# Altium project CPU_Board_V1_2.PrjPcb (part 1 of 2)
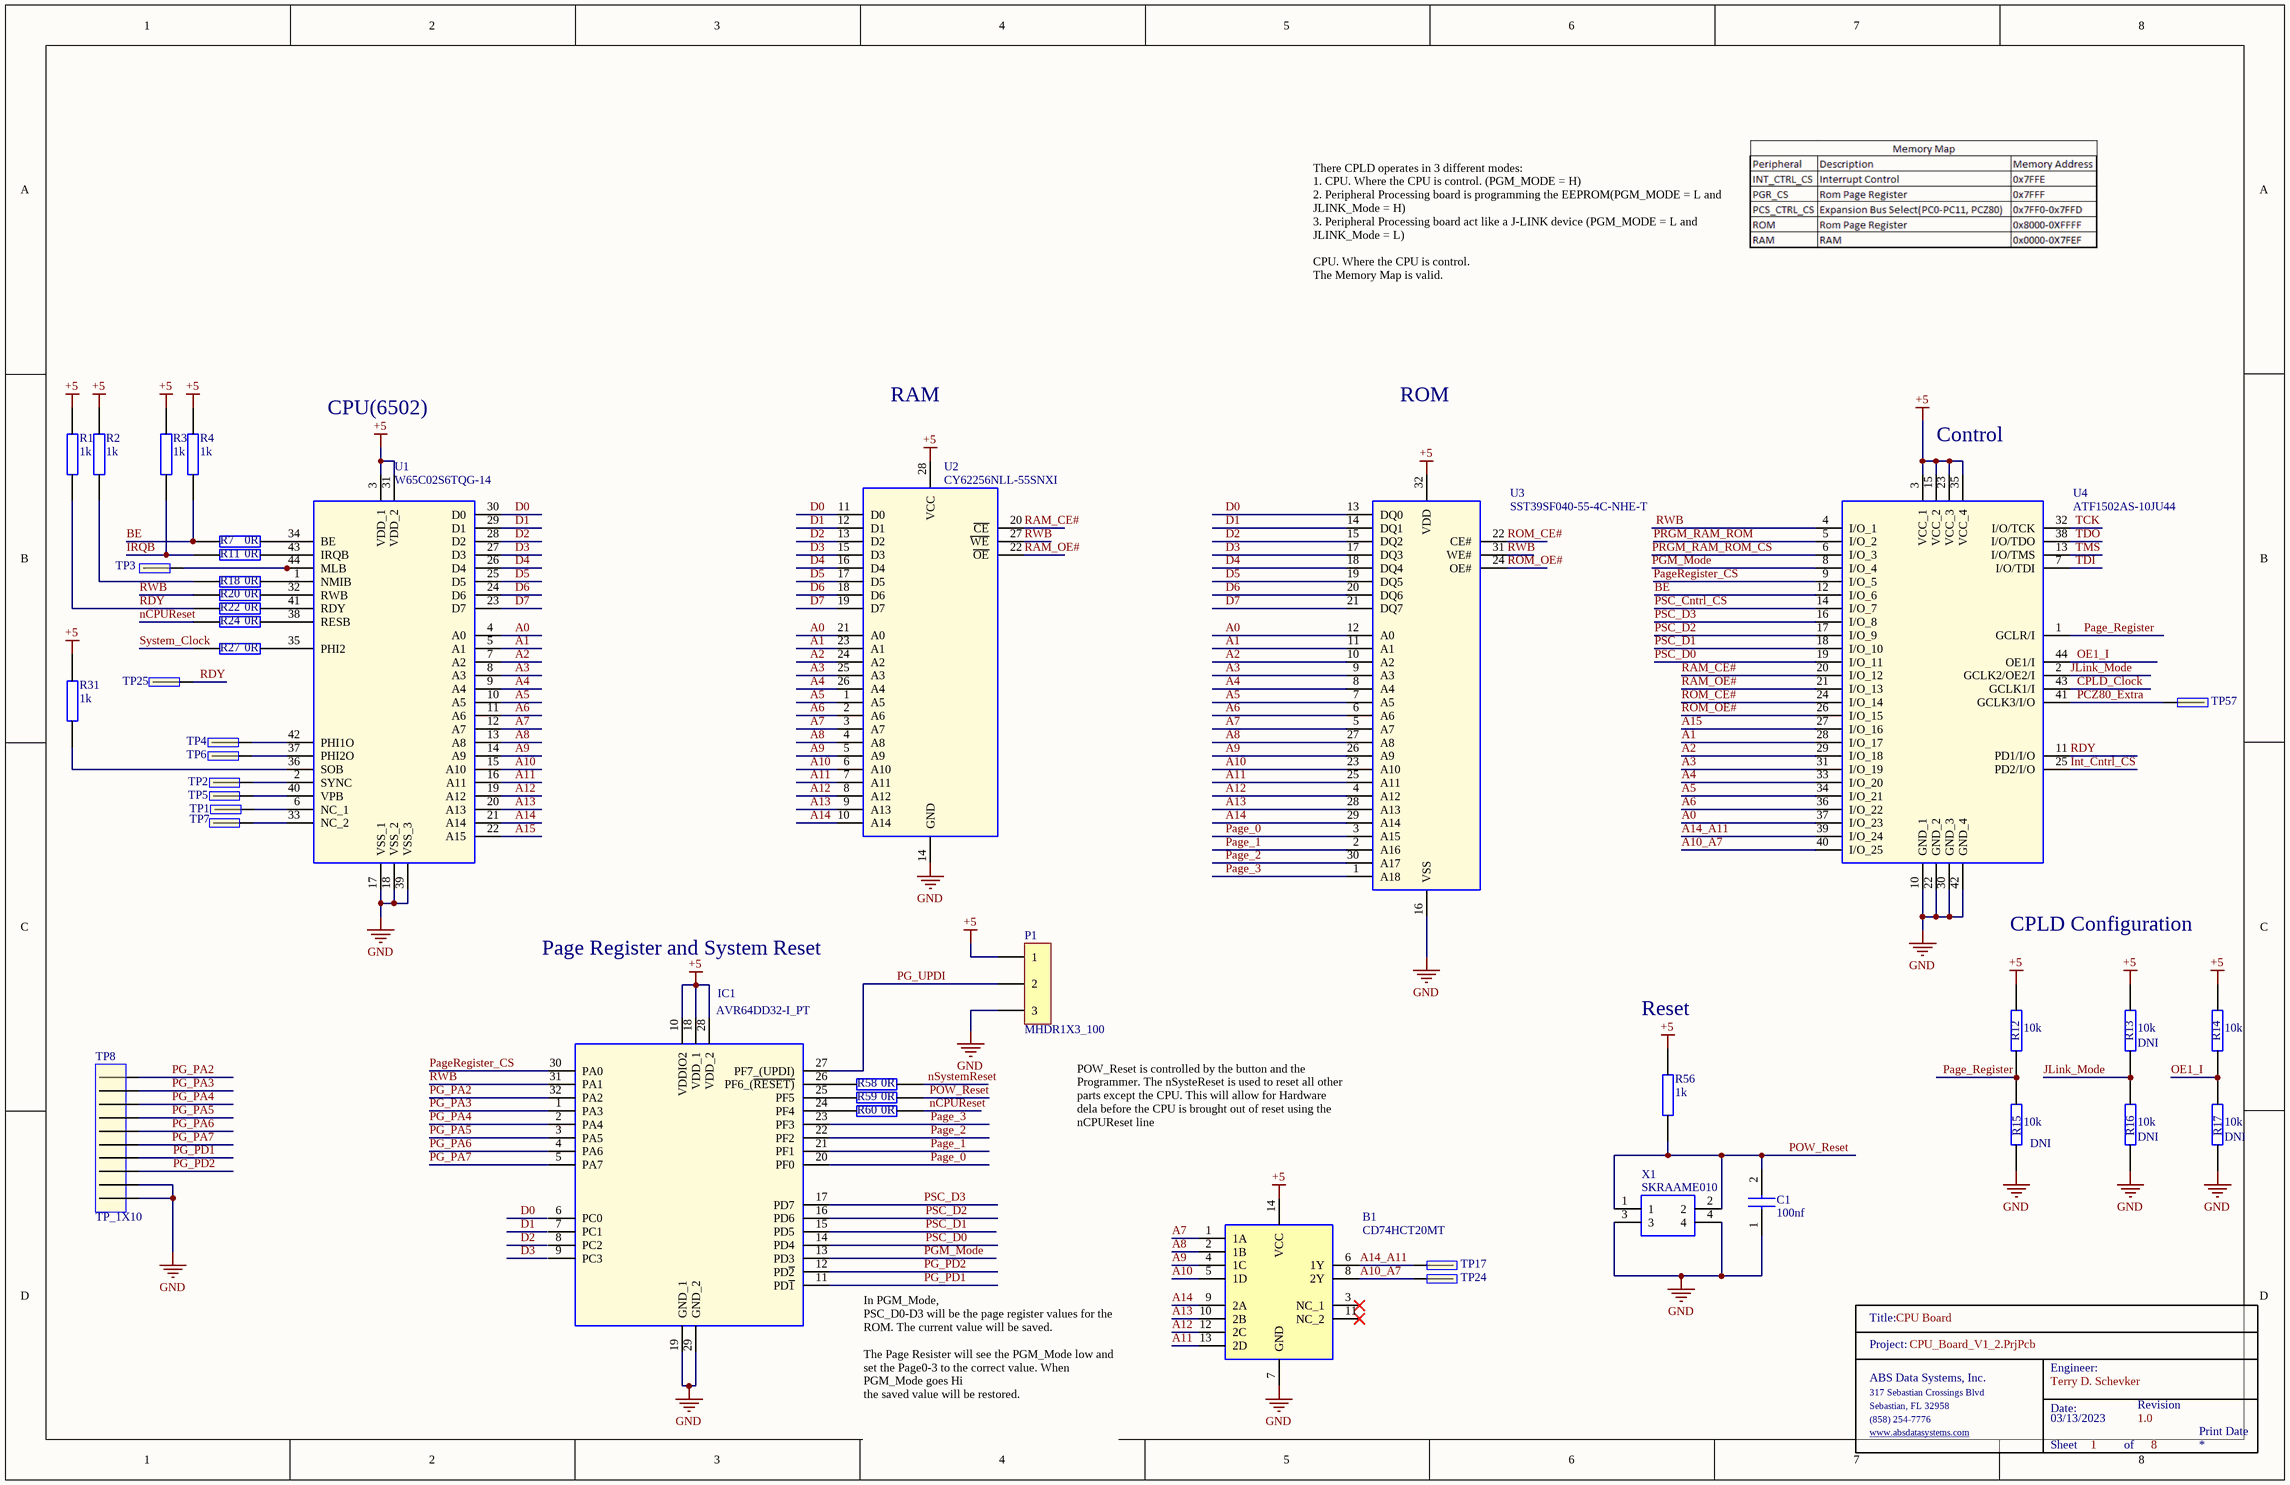
[diagram p0: CPU_Board.SchDoc]
8 sheets, 394 parts. Net scope: global (net labels, ports and power ports of the same name join across sheets).
Board file: 6502_CPU_MainBoard_PCB_V1_2.PcbDoc
Sheets:
  CPU_Board.SchDoc
  LED_Monitor.SchDoc
  LED_Monitor_2.SchDoc
  Peripherial_Bus.SchDoc
  PowerSupply.SchDoc
  Programmer_Interface.SchDoc
  TestPoints.SchDoc
  Z80_Interface.SchDoc

## Sheet CPU_Board.SchDoc: CPU Board
size Tabloid; Date: 03/13/2023; Engineer: Terry D. Schevker; Revision: 1.0; SheetNumber: 1; SheetTotal: 8

### Parts
B1  CD74HCT20MT  [SOIC127P600X175-14N]
C1  100nf  [0603]
IC1  AVR64DD32-I_PT  [QFP80P900X900X120-32N]
P1  MHDR1X3_100  [MHDR1X3_100]
R1  1k  [0603]
R2  1k  [0603]
R3  1k  [0603]
R4  1k  [0603]
R7  0R  [0603]
R11  0R  [0603]
R12  10k  [0603]
R13  10k  [0603]
R14  10k  [0603]
R15  10k  [0603]
R16  10k  [0603]
R17  10k  [0603]
R18  0R  [0603]
R20  0R  [0603]
R22  0R  [0603]
R24  0R  [0603]
R27  0R  [0603]
R31  1k  [0603]
R56  1k  [0603]
R58  0R  [0603]
R59  0R  [0603]
R60  0R  [0603]
TitleBlock_1  TitleBlock  (value not drawn)  (graphical)
TP1  TP  [TP]  (value not drawn)
TP2  TP  [TP]  (value not drawn)
TP3  TP  [TP]  (value not drawn)
TP4  TP  [TP]  (value not drawn)
TP5  TP  [TP]  (value not drawn)
TP6  TP  [TP]  (value not drawn)
TP7  TP  [TP]  (value not drawn)
TP8  TP_1X10  [TP_1X10]
TP17  TP  [TP]  (value not drawn)
TP24  TP  [TP]  (value not drawn)
TP25  TP  [TP]  (value not drawn)
TP57  TP  [TP]  (value not drawn)
U1  W65C02S6TQG-14  [QFP-44]
U2  CY62256NLL-55SNXI  [SOP-28]
U3  SST39SF040-55-4C-NHE-T  [plcc-32]
U4  ATF1502AS-10JU44  [PLCC-44N]
X1  SKRAAME010  [SKRAAME010]

### Nets
+5: B1.14(VCC) IC1.10(VDDIO2) IC1.18(VDD_1) IC1.28(VDD_2) P1.1 R1.2 R2.2 R3.2 R4.2 R12.1 R13.1 R14.1 R31.2 R56.1 U1.3(VDD_1) U1.31(VDD_2) U2.28(VCC) U3.32(VDD) U4.3(VCC_1) U4.15(VCC_2) U4.23(VCC_3) U4.35(VCC_4)
GND: B1.7(GND) C1.1 IC1.19(GND_1) IC1.29(GND_2) P1.3 R15.2 R16.2 R17.2 TP8.9 TP8.10 U1.17(VSS_1) U1.18(VSS_2) U1.39(VSS_3) U2.14(GND) U3.16(VSS) U4.10(GND_1) U4.22(GND_2) U4.30(GND_3) U4.42(GND_4) X1.3 X1.4
A0: U1.4(A0) U2.21(A0) U3.12(A0) U4.37(I/O_23)
A1: U1.5(A1) U2.23(A1) U3.11(A1) U4.28(I/O_17)
A2: U1.7(A2) U2.24(A2) U3.10(A2) U4.29(I/O_18)
A3: U1.8(A3) U2.25(A3) U3.9(A3) U4.31(I/O_19)
A4: U1.9(A4) U2.26(A4) U3.8(A4) U4.33(I/O_20)
A5: U1.10(A5) U2.1(A5) U3.7(A5) U4.34(I/O_21)
A6: U1.11(A6) U2.2(A6) U3.6(A6) U4.36(I/O_22)
A7: B1.1(1A) U1.12(A7) U2.3(A7) U3.5(A7)
A8: B1.2(1B) U1.13(A8) U2.4(A8) U3.27(A8)
A9: B1.4(1C) U1.14(A9) U2.5(A9) U3.26(A9)
A10: B1.5(1D) U1.15(A10) U2.6(A10) U3.23(A10)
A10_A7: B1.8(2Y) TP24.1 U4.40(I/O_25)
A11: B1.13(2D) U1.16(A11) U2.7(A11) U3.25(A11)
A12: B1.12(2C) U1.19(A12) U2.8(A12) U3.4(A12)
A13: B1.10(2B) U1.20(A13) U2.9(A13) U3.28(A13)
A14: B1.9(2A) U1.21(A14) U2.10(A14) U3.29(A14)
A14_A11: B1.6(1Y) TP17.1 U4.39(I/O_24)
A15: U1.22(A15) U4.27(I/O_16)
BE: R4.1 R7.1 U4.12(I/O_6)
CPLD_Clock: U4.43(GCLK1/I)
D0: U1.30(D0) U2.11(D0) U3.13(DQ0)
D1: U1.29(D1) U2.12(D1) U3.14(DQ1)
D2: U1.28(D2) U2.13(D2) U3.15(DQ2)
D3: U1.27(D3) U2.15(D3) U3.17(DQ3)
D4: U1.26(D4) U2.16(D4) U3.18(DQ4)
D5: U1.25(D5) U2.17(D5) U3.19(DQ5)
D6: U1.24(D6) U2.18(D6) U3.20(DQ6)
D7: U1.23(D7) U2.19(D7) U3.21(DQ7)
Int_Cntrl_CS: U4.25(PD2/I/O)
IRQB: R3.1 R11.1
JLink_Mode: R13.2 R16.1 U4.2(GCLK2/OE2/I)
nCPUReset: R24.1 R60.2
nSystemReset: R58.2
OE1_I: R14.2 R17.1 U4.44(OE1/I)
Page_0: IC1.20(PF0) U3.3(A15)
Page_1: IC1.21(PF1) U3.2(A16)
Page_2: IC1.22(PF2) U3.30(A17)
Page_3: IC1.23(PF3) U3.1(A18)
Page_Register: R12.2 R15.1 U4.1(GCLR/I)
PageRegister_CS: IC1.30(PA0) U4.9(I/O_5)
PCZ80_Extra: TP57.1 U4.41(GCLK3/I/O)
PG_PA2: IC1.32(PA2) TP8.1
PG_PA3: IC1.1(PA3) TP8.2
PG_PA4: IC1.2(PA4) TP8.3
PG_PA5: IC1.3(PA5) TP8.4
PG_PA6: IC1.4(PA6) TP8.5
PG_PA7: IC1.5(PA7) TP8.6
PG_PD1: IC1.11(PD~{1}) TP8.7
PG_PD2: IC1.12(PD~{2}) TP8.8
PG_UPDI: IC1.27(PF7_(UPDI)) P1.2
PGM_Mode: IC1.13(PD3) U4.8(I/O_4)
POW_Reset: C1.2 R56.2 R59.2 X1.1 X1.2
PRGM_RAM_ROM: U4.5(I/O_2)
PRGM_RAM_ROM_CS: U4.6(I/O_3)
PSC_Cntrl_CS: U4.14(I/O_7)
PSC_D0: IC1.14(PD4) U4.19(I/O_11)
PSC_D1: IC1.15(PD5) U4.18(I/O_10)
PSC_D2: IC1.16(PD6) U4.17(I/O_9)
PSC_D3: IC1.17(PD7) U4.16(I/O_8)
RAM_CE#: U2.20(~{CE}) U4.20(I/O_12)
RAM_OE#: U2.22(~{OE}) U4.21(I/O_13)
RDY: R1.1 R22.1 TP25.1 U4.11(PD1/I/O)
ROM_CE#: U3.22(CE#) U4.24(I/O_14)
ROM_OE#: U3.24(OE#) U4.26(I/O_15)
RWB: IC1.31(PA1) R20.1 U2.27(~{WE}) U3.31(WE#) U4.4(I/O_1)
System_Clock: R27.1
TCK: U4.32(I/O/TCK)
TDI: U4.7(I/O/TDI)
TDO: U4.38(I/O/TDO)
TMS: U4.13(I/O/TMS)
NetIC1_24: IC1.24(PF4) R60.1
NetIC1_25: IC1.25(PF5) R59.1
NetIC1_26: IC1.26(PF6_(~{RESET)}) R58.1
NetR2_1: R2.1 R18.1
NetR7_2: R7.2 U1.34(BE)
NetR11_2: R11.2 U1.43(IRQB)
NetR18_2: R18.2 U1.1(NMIB)
NetR20_2: R20.2 U1.32(RWB)
NetR22_2: R22.2 U1.41(RDY)
NetR24_2: R24.2 U1.38(RESB)
NetR27_2: R27.2 U1.35(PHI2)
NetR31_1: R31.1 U1.36(SOB)
NetTP1_1: TP1.1 U1.6(NC_1)
NetTP2_1: TP2.1 U1.2(SYNC)
NetTP3_1: TP3.1 U1.44(MLB)
NetTP4_1: TP4.1 U1.42(PHI1O)
NetTP5_1: TP5.1 U1.40(VPB)
NetTP6_1: TP6.1 U1.37(PHI2O)
NetTP7_1: TP7.1 U1.33(NC_2)

Not connected (* = marked no-connect by the designer): B1 3(NC_1)* 11(NC_2)*; IC1 6(PC0) 7(PC1) 8(PC2) 9(PC3)

### Notes on the sheet
- There CPLD operates in 3 different modes:
  1. CPU. Where the CPU is control. (PGM_MODE = H)
  2. Peripheral Processing board is programming the EEPROM(PGM_MODE = L and JLINK_Mode = H)
  3. Peripheral Processing board act like a J-LINK device (PGM_MODE = L and JLINK_Mode = L)
  CPU. Where the CPU is control.
  The Memory Map is valid.
- CPU(6502)
- RAM
- ROM
- Control
- Page Register and System Reset
- CPLD Configuration
- Reset
- (near R13) DNI
- POW_Reset is controlled by the button and the Programmer. The nSysteReset is used to reset all other parts except the CPU. This will allow for Hardware dela before the CPU is brought out of reset using the nCPUReset line
- (near R15) DNI
- (near R16) DNI
- (near R17) DNI
- Print Date
- In PGM_Mode,
  PSC_D0-D3 will be the page register values for the
  ROM. The current value will be saved.
  The Page Resister will see the PGM_Mode low and set the Page0-3 to the correct value. When PGM_Mode goes Hi
  the saved value will be restored.
- (in symbol TitleBlock) Title:; Project:; Engineer:; ABS Data Systems, Inc.; 317 Sebastian Crossings Blvd; Sebastian, FL 32958; Date:; Revision; (858) 254-7776; www.absdatasystems.com; Sheet; of

### Library data of the parts
B1 = CD74HCT20MT: Texas Instruments CD74HCT20MT, Dual 4-Input NAND Logic Gate, 14-Pin SOIC; Geometry.Height: 1.75mm; Mouser Part Number: 595-CD74HCT20MT; Mouser Price/Stock: https://www.mouser.co.uk/ProductDetail/Texas-Instruments/CD74HCT20MT?qs=xFfolx0DHx2dg0PqLn7e%252Bw%3D%3D; Manufacturer_Name: Texas Instruments; Manufacturer_Part_Number: CD74HCT20MT; Datasheet Link: https://www.ti.com/general/docs/suppproductinfo.tsp?distId=10&gotoUrl=https%3A%2F%2Fwww.ti.com%2Flit%2Fgpn%2Fcd74hct20
C1 = CL10B104JB8NNNC: Samsung Electro-Mechanics 0603 100nf
IC1 = AVR64DD32-I_PT: Integrated Circuit; Manufacturer_Name: Microchip; Manufacturer_Part_Number: AVR64DD32-I/PT | MULTI-VOLTAGE I/O; Datasheet Link: https://www.microchip.com/en-us/product/AVR64DD32; Height: 1.2mm
P1 = MHDR1X3_100: Header, 3-Pin; LatestRevisionDate: 17-Jul-2002; LatestRevisionNote: Re-released for DXP Platform.; Publisher: Altium Limited
R1-R4 R31 R56 = AC0603FR-7W1KL: YAGEO 0603 1k ohm; Manufacturer_Name: KEMET; Manufacturer_Part_Number: RC0603JR-070RL; Geometry.Height: 0.55mm; Mouser Part Number: 603-RC0603JR-070RL; Mouser Price/Stock: https://www.mouser.co.uk/ProductDetail/YAGEO/RC0603JR-070RL?qs=2cAdsCoAWRGWyPcuXgGiXQ%3D%3D; Datasheet Link: https://datasheet.datasheetarchive.com/originals/distributors/Datasheets_SAMA/902f9e387b938f871d31120f5fc1d65e.pdf
R7 R11 R18 R20 R22 R24 R27 R58-R60 = RC0603JR-070RL: YAGEO 0603 0 ohm; Manufacturer_Name: KEMET; Geometry.Height: 0.55mm; Mouser Part Number: 603-RC0603JR-070RL; Mouser Price/Stock: https://www.mouser.co.uk/ProductDetail/YAGEO/RC0603JR-070RL?qs=2cAdsCoAWRGWyPcuXgGiXQ%3D%3D; Manufacturer_Part_Number: RC0603JR-070RL; Datasheet Link: https://datasheet.datasheetarchive.com/originals/distributors/Datasheets_SAMA/902f9e387b938f871d31120f5fc1d65e.pdf
R12-R17 = RC0603JR-0710KL: YAGEO 0603 10k ohm; Manufacturer_Name: KEMET; Manufacturer_Part_Number: RC0603JR-070RL; Geometry.Height: 0.55mm; Mouser Part Number: 603-RC0603JR-070RL; Mouser Price/Stock: https://www.mouser.co.uk/ProductDetail/YAGEO/RC0603JR-070RL?qs=2cAdsCoAWRGWyPcuXgGiXQ%3D%3D; Datasheet Link: https://datasheet.datasheetarchive.com/originals/distributors/Datasheets_SAMA/902f9e387b938f871d31120f5fc1d65e.pdf
TP1-TP7 TP17 TP24 TP25 TP57 = TP: Manufacturer: Samtec; Manufacturer Part Number: TST-105-01-G-D; Number of Contacts: 16; Gender: Male; Connector Type: Male Pin; Pitch: 2.54mm; Row Spacing: 0.1inch; Supplier 1: Digi-Key; RoHS: Yes; Category: Headers and Wire Housings; Stock 1: 227; Pricing 1: 1=2.85000, 10=2.73600, 100=2.28000, 500=1.93800, 1000=1.65300, 5000=1.48200 (USD); Mount: Through Hole; Contact Plating: Gold; Contact Material: Bronze; Housing Material: Polyester; Housing Color: Black; Color: Black; Min Operating Temperature: -55°C; Max Operating Temperature: 125°C; Number of Rows: 2; Termination: Solder; Packaging: Rail/Tube; Orientation: Straight; Number of Positions: 16; Length: 27.94mm; Depth: 9.27mm; Contact Mating Length: 0.25inch; REACH SVHC: No SVHC; ComponentLink1URL: https://datasheet.ciiva.com/739/tst-mkt-739845.pdf?src-supplier=Digi-Key; ComponentLink1Description: https://datasheet.ciiva.com/739/tst-mkt-739845.pdf?src-supplier=Digi-Key; ComponentLink2URL: https://datasheet.ciiva.com/10018/htst-10018510.pdf?src-supplier=Avnet; ComponentLink2Description: https://datasheet.ciiva.com/10018/htst-10018510.pdf?src-supplier=Avnet
TP8 = TP_1X10: Manufacturer: Samtec; Manufacturer Part Number: TST-105-01-G-D; Number of Contacts: 16; Gender: Male; Connector Type: Male Pin; Pitch: 2.54mm; Row Spacing: 0.1inch; Supplier 1: Digi-Key; RoHS: Yes; Category: Headers and Wire Housings; Stock 1: 227; Pricing 1: 1=2.85000, 10=2.73600, 100=2.28000, 500=1.93800, 1000=1.65300, 5000=1.48200 (USD); Mount: Through Hole; Contact Plating: Gold; Contact Material: Bronze; Housing Material: Polyester; Housing Color: Black; Color: Black; Min Operating Temperature: -55°C; Max Operating Temperature: 125°C; Number of Rows: 2; Termination: Solder; Packaging: Rail/Tube; Orientation: Straight; Number of Positions: 16; Length: 27.94mm; Depth: 9.27mm; Contact Mating Length: 0.25inch; REACH SVHC: No SVHC; ComponentLink1URL: https://datasheet.ciiva.com/739/tst-mkt-739845.pdf?src-supplier=Digi-Key; ComponentLink1Description: https://datasheet.ciiva.com/739/tst-mkt-739845.pdf?src-supplier=Digi-Key; ComponentLink2URL: https://datasheet.ciiva.com/10018/htst-10018510.pdf?src-supplier=Avnet; ComponentLink2Description: https://datasheet.ciiva.com/10018/htst-10018510.pdf?src-supplier=Avnet
U1 = W65C02S6TQG-14: Microprocessors - MPU 8-bit Microprocessor; Manufacturer_Name: Western Design Center (WDC); Geometry.Height: 2.7mm; Mouser Part Number: 955-W65C02S6TQG-14; Mouser Price/Stock: https://www.mouser.co.uk/ProductDetail/Western-Design-Center-WDC/W65C02S6TQG-14?qs=opBjA1TV900Cx5CoX8hQeQ%3D%3D; Manufacturer_Part_Number: W65C02S6TQG-14; Datasheet Link: http://www.westerndesigncenter.com/wdc/documentation/w65c02s.pdf
U2 = CY62256NLL-55SNXI: SRAM 256K 32K x 8 4.5-5.5V 28pin 330mil SOP Industrial (-40 85 C) Low Power Asynch; Manufacturer_Name: Alliance Memory; Geometry.Height: 2.794mm; Mouser Part Number: 913-CY62256NLL55SNXI; Mouser Price/Stock: https://www.mouser.co.uk/ProductDetail/Alliance-Memory/CY62256NLL-55SNXI?qs=byeeYqUIh0Pp3ev9t84NaQ%3D%3D; Manufacturer_Part_Number: CY62256NLL-55SNXI; Datasheet Link: https://www.cypress.com/file/43841/download
U3 = SST39SF040-55-4C-NHE-T: NOR Flash 4.5 to 5.5 1Mbit Multi-Purpose Flash; MicroChip Part Number: SST39SF040-55-4C-NHE-T; Supplier: Mouser; Mouser Part Number: 579-39SF040554CNHET
U4 = ATF1502AS-10JU44: ATF1502AS-10JU44, CPLD ATF1502AS EEPROM 32 Cells, 32 I/O, 2 Labs, 10ns, ISP, 4.75  5.25 V 44-Pin PLCC; Manufacturer_Name: Microchip; Geometry.Height: 4.572mm; Mouser Part Number: 556-AF1502AS10JU44; Mouser Price/Stock: https://www.mouser.co.uk/ProductDetail/Microchip-Technology-Atmel/ATF1502AS-10JU44?qs=fH4tvdCgwtOmGOXETrb9sw%3D%3D; Manufacturer_Part_Number: ATF1502AS-10JU44; Datasheet Link: http://ww1.microchip.com/downloads/en/DeviceDoc/Atmel-0995-CPLD-ATF1502AS(L)-Datasheet.pdf
X1 = SKRAAME010: ALPS - SKRAAME010 - SWITCH, SMD, 1.96N, 6.2X6.2MM; Manufacturer_Name: ALPS Electric; Geometry.Height: 5.3mm; Mouser Part Number: 688-SKRAAME010; Mouser Price/Stock: https://www.mouser.com/Search/Refine.aspx?Keyword=688-SKRAAME010; Manufacturer_Part_Number: SKRAAME010; Datasheet Link: https://componentsearchengine.com/Datasheets/1/SKRAAME010.pdf

## Sheet LED_Monitor.SchDoc: LED Monitor
size Tabloid; Date: 12/20/2022; Engineer: Terry D. Schevker; Revision: 1.0; SheetNumber: 2; SheetTotal: 8
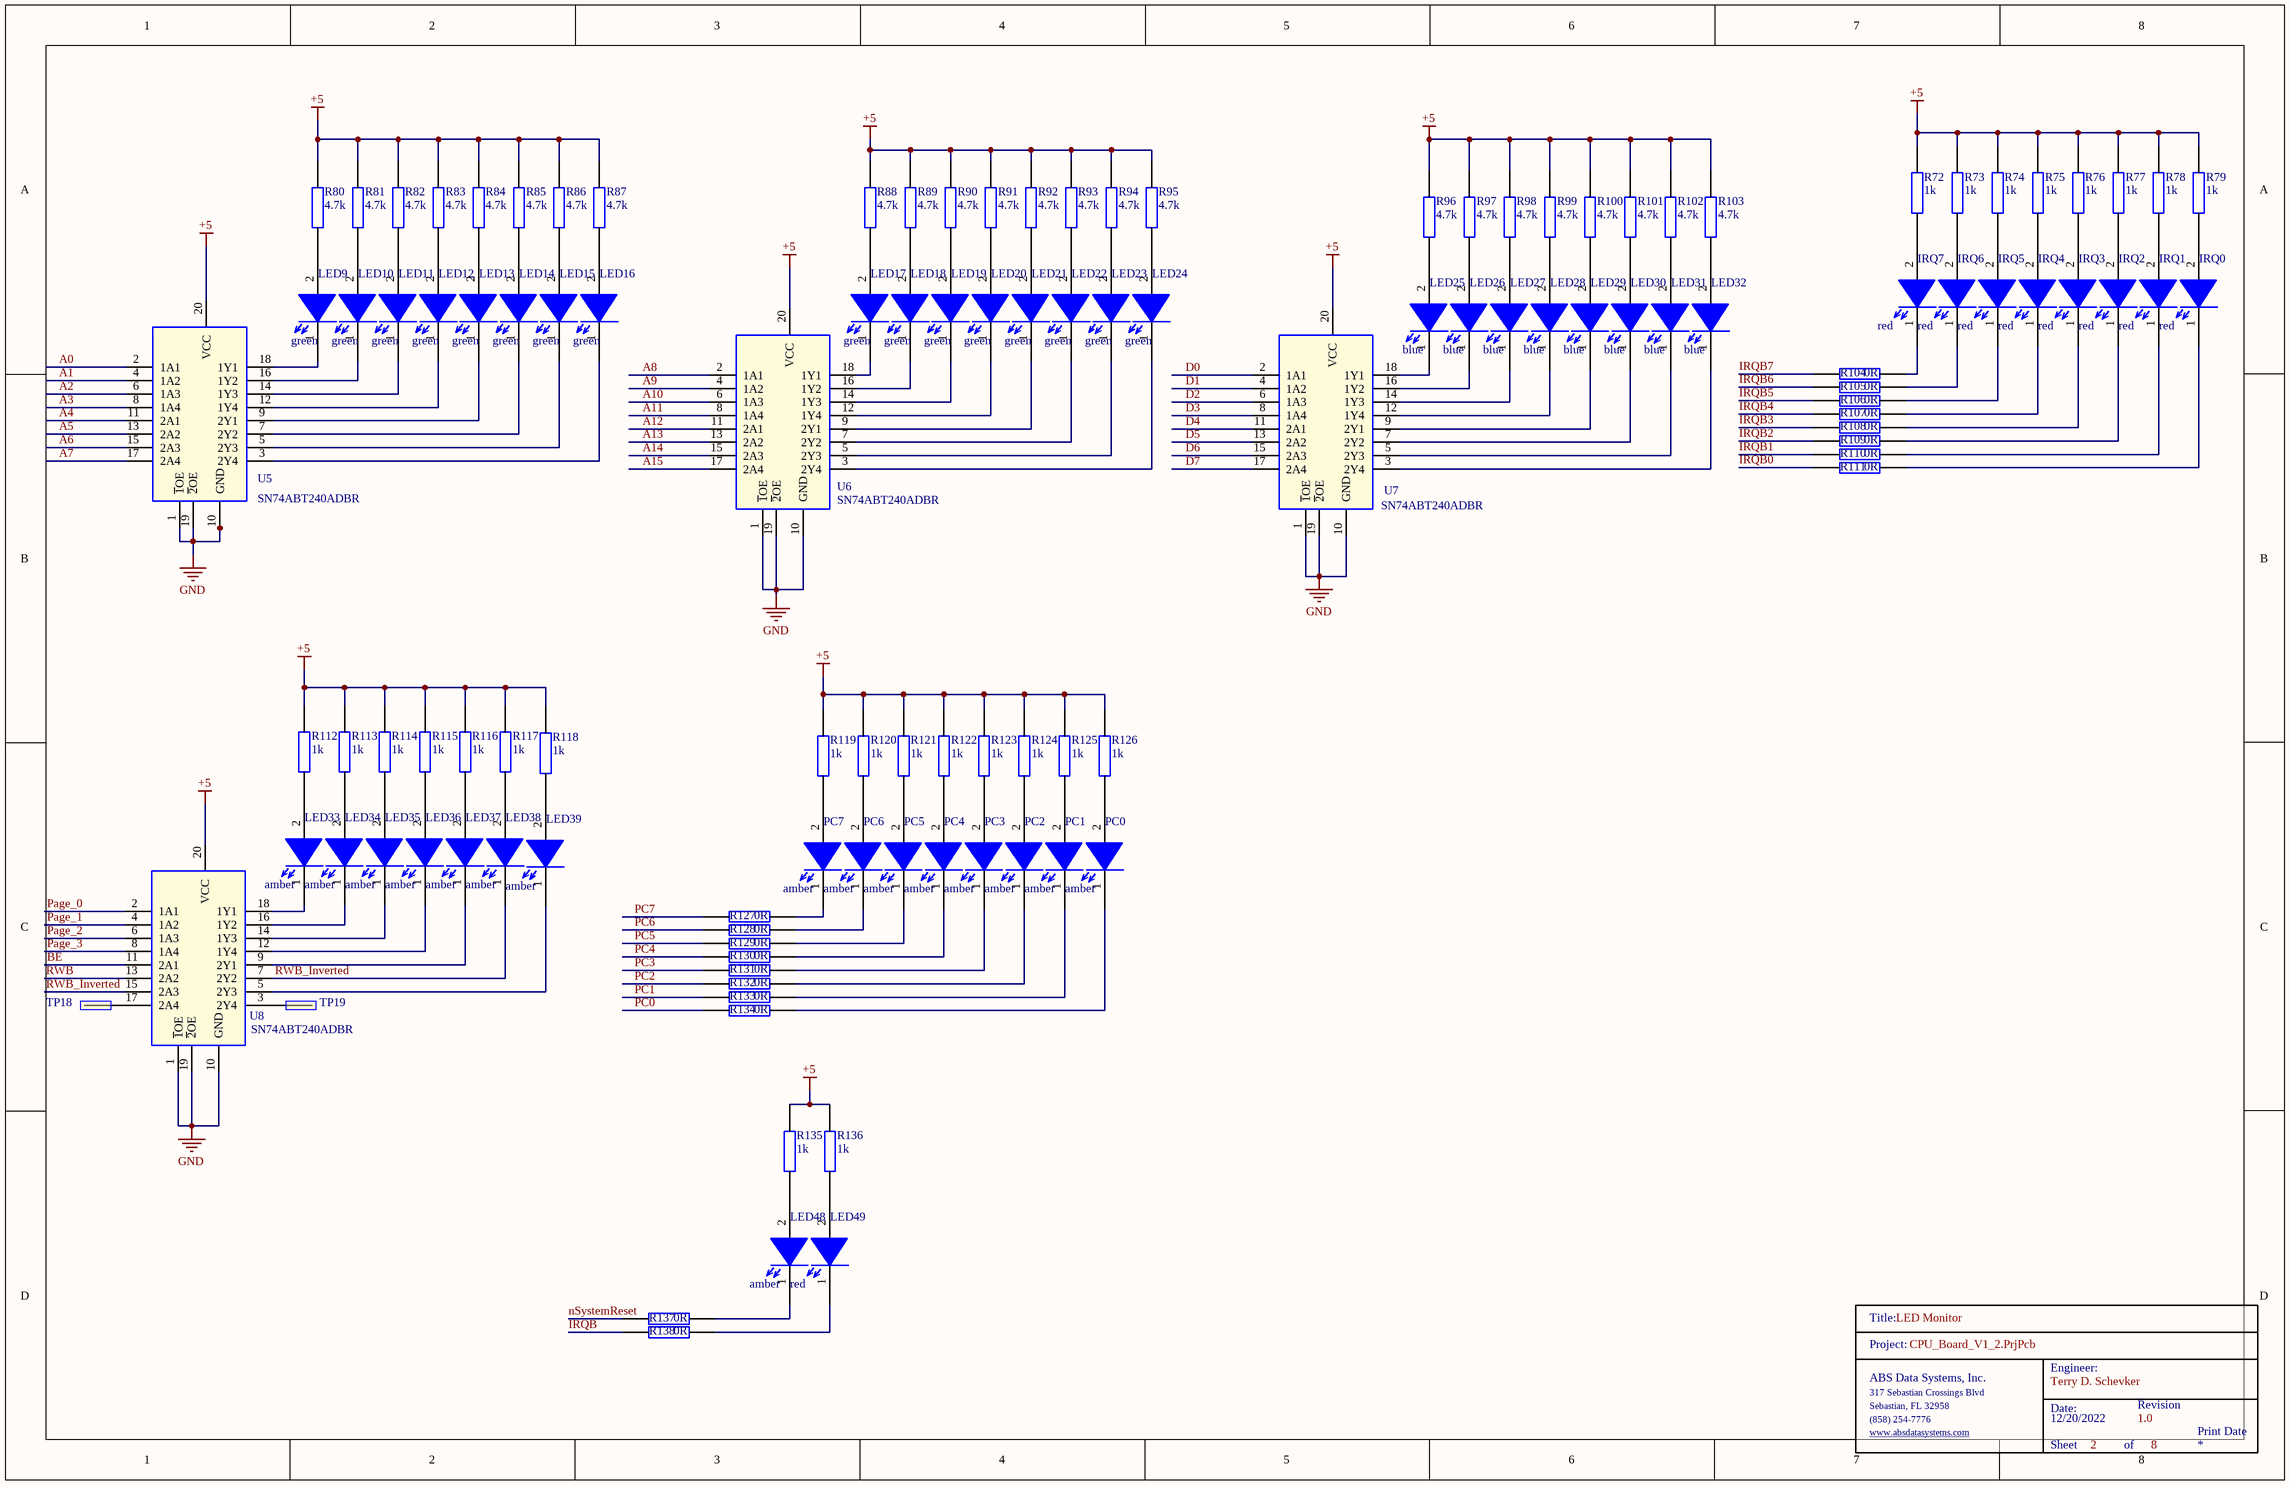
[diagram p1: LED_Monitor.SchDoc]

### Parts
(Parts that share a designator on the sheet are numbered #1, #2 ... from top to bottom, then left to right.)
IRQ0  red  [0603_Diode]
IRQ1  red  [0603_Diode]
IRQ2  red  [0603_Diode]
IRQ3  red  [0603_Diode]
IRQ4  red  [0603_Diode]
IRQ5  red  [0603_Diode]
IRQ6  red  [0603_Diode]
IRQ7  red  [0603_Diode]
LED9  green  [0603_Diode]
LED10  green  [0603_Diode]
LED11  green  [0603_Diode]
LED12  green  [0603_Diode]
LED13  green  [0603_Diode]
LED14  green  [0603_Diode]
LED15  green  [0603_Diode]
LED16  green  [0603_Diode]
LED17  green  [0603_Diode]
LED18  green  [0603_Diode]
LED19  green  [0603_Diode]
LED20  green  [0603_Diode]
LED21  green  [0603_Diode]
LED22  green  [0603_Diode]
LED23  green  [0603_Diode]
LED24  green  [0603_Diode]
LED25  blue  [0603_Diode]
LED26  blue  [0603_Diode]
LED27  blue  [0603_Diode]
LED28  blue  [0603_Diode]
LED29  blue  [0603_Diode]
LED30  blue  [0603_Diode]
LED31  blue  [0603_Diode]
LED32  blue  [0603_Diode]
LED33  amber  [0603_Diode]
LED34  amber  [0603_Diode]
LED35  amber  [0603_Diode]
LED36  amber  [0603_Diode]
LED37  amber  [0603_Diode]
LED38  amber  [0603_Diode]
LED39  amber  [0603_Diode]
LED48  amber  [0603_Diode]
LED49  red  [0603_Diode]
PC0  amber  [0603_Diode]
PC1  amber  [0603_Diode]
PC2  amber  [0603_Diode]
PC3  amber  [0603_Diode]
PC4  amber  [0603_Diode]
PC5  amber  [0603_Diode]
PC6  amber  [0603_Diode]
PC7  amber  [0603_Diode]
R72  1k  [0603]
R73  1k  [0603]
R74  1k  [0603]
R75  1k  [0603]
R76  1k  [0603]
R77  1k  [0603]
R78  1k  [0603]
R79  1k  [0603]
R80  4.7k  [0603]
R81  4.7k  [0603]
R82  4.7k  [0603]
R83  4.7k  [0603]
R84  4.7k  [0603]
R85  4.7k  [0603]
R86  4.7k  [0603]
R87  4.7k  [0603]
R88  4.7k  [0603]
R89  4.7k  [0603]
R90  4.7k  [0603]
R91  4.7k  [0603]
R92  4.7k  [0603]
R93  4.7k  [0603]
R94  4.7k  [0603]
R95  4.7k  [0603]
R96  4.7k  [0603]
R97  4.7k  [0603]
R98  4.7k  [0603]
R99  4.7k  [0603]
R100  4.7k  [0603]
R101  4.7k  [0603]
R102  4.7k  [0603]
R103  4.7k  [0603]
R104  0R  [0603]
R105  0R  [0603]
R106  0R  [0603]
R107  0R  [0603]
R108  0R  [0603]
R109  0R  [0603]
R110  0R  [0603]
R111  0R  [0603]
R112  1k  [0603]
R113  1k  [0603]
R114  1k  [0603]
R115  1k  [0603]
R116  1k  [0603]
R117  1k  [0603]
R118  1k  [0603]
R119  1k  [0603]
R120  1k  [0603]
R121  1k  [0603]
R122  1k  [0603]
R123  1k  [0603]
R124  1k  [0603]
R125  1k  [0603]
R126  1k  [0603]
R127  0R  [0603]
R128  0R  [0603]
R129  0R  [0603]
R130  0R  [0603]
R131  0R  [0603]
R132  0R  [0603]
R133  0R  [0603]
R134  0R  [0603]
R135  1k  [0603]
R136  1k  [0603]
R137  0R  [0603]
R138  0R  [0603]
TitleBlock_2#1  TitleBlock  (value not drawn)  (graphical)
TP18  TP  [TP]  (value not drawn)
TP19  TP  [TP]  (value not drawn)
U5  SN74ABT240ADBR  [SOP65P780X200-20N]
U6  SN74ABT240ADBR  [SOP65P780X200-20N]
U7  SN74ABT240ADBR  [SOP65P780X200-20N]
U8  SN74ABT240ADBR  [SOP65P780X200-20N]

### Nets
+5: R72.1 R73.1 R74.1 R75.1 R76.1 R77.1 R78.1 R79.1 R80.2 R81.2 R82.2 R83.2 R84.2 R85.2 R86.2 R87.2 R88.2 R89.2 R90.2 R91.2 R92.2 R93.2 R94.2 R95.2 R96.1 R97.1 R98.1 R99.1 R100.1 R101.1 R102.1 R103.1 R112.1 R113.1 R114.1 R115.1 R116.1 R117.1 R118.1 R119.1 R120.1 R121.1 R122.1 R123.1 R124.1 R125.1 R126.1 R135.1 R136.1 U5.20(VCC) U6.20(VCC) U7.20(VCC) U8.20(VCC)
GND: U5.1(~{1}OE) U5.10(GND) U5.19(~{2}OE) U6.1(~{1}OE) U6.10(GND) U6.19(~{2}OE) U7.1(~{1}OE) U7.10(GND) U7.19(~{2}OE) U8.1(~{1}OE) U8.10(GND) U8.19(~{2}OE)
A0: U5.2(1A1)
A1: U5.4(1A2)
A2: U5.6(1A3)
A3: U5.8(1A4)
A4: U5.11(2A1)
A5: U5.13(2A2)
A6: U5.15(2A3)
A7: U5.17(2A4)
A8: U6.2(1A1)
A9: U6.4(1A2)
A10: U6.6(1A3)
A11: U6.8(1A4)
A12: U6.11(2A1)
A13: U6.13(2A2)
A14: U6.15(2A3)
A15: U6.17(2A4)
BE: U8.11(2A1)
D0: U7.2(1A1)
D1: U7.4(1A2)
D2: U7.6(1A3)
D3: U7.8(1A4)
D4: U7.11(2A1)
D5: U7.13(2A2)
D6: U7.15(2A3)
D7: U7.17(2A4)
IRQB: R138.1
IRQB0: R111.1
IRQB1: R110.1
IRQB2: R109.1
IRQB3: R108.1
IRQB4: R107.1
IRQB5: R106.1
IRQB6: R105.1
IRQB7: R104.1
nSystemReset: R137.1
Page_0: U8.2(1A1)
Page_1: U8.4(1A2)
Page_2: U8.6(1A3)
Page_3: U8.8(1A4)
PC0: R134.1
PC1: R133.1
PC2: R132.1
PC3: R131.1
PC4: R130.1
PC5: R129.1
PC6: R128.1
PC7: R127.1
RWB: U8.13(2A2)
RWB_Inverted: LED38.1(K) U8.7(2Y2) U8.15(2A3)
NetIRQ0_1: IRQ0.1(K) R111.2
NetIRQ0_2: IRQ0.2(A) R79.2
NetIRQ1_1: IRQ1.1(K) R110.2
NetIRQ1_2: IRQ1.2(A) R78.2
NetIRQ2_1: IRQ2.1(K) R109.2
NetIRQ2_2: IRQ2.2(A) R77.2
NetIRQ3_1: IRQ3.1(K) R108.2
NetIRQ3_2: IRQ3.2(A) R76.2
NetIRQ4_1: IRQ4.1(K) R107.2
NetIRQ4_2: IRQ4.2(A) R75.2
NetIRQ5_1: IRQ5.1(K) R106.2
NetIRQ5_2: IRQ5.2(A) R74.2
NetIRQ6_1: IRQ6.1(K) R105.2
NetIRQ6_2: IRQ6.2(A) R73.2
NetIRQ7_1: IRQ7.1(K) R104.2
NetIRQ7_2: IRQ7.2(A) R72.2
NetLED9_1: LED9.1(K) U5.18(1Y1)
NetLED9_2: LED9.2(A) R80.1
NetLED10_1: LED10.1(K) U5.16(1Y2)
NetLED10_2: LED10.2(A) R81.1
NetLED11_1: LED11.1(K) U5.14(1Y3)
NetLED11_2: LED11.2(A) R82.1
NetLED12_1: LED12.1(K) U5.12(1Y4)
NetLED12_2: LED12.2(A) R83.1
NetLED13_1: LED13.1(K) U5.9(2Y1)
NetLED13_2: LED13.2(A) R84.1
NetLED14_1: LED14.1(K) U5.7(2Y2)
NetLED14_2: LED14.2(A) R85.1
NetLED15_1: LED15.1(K) U5.5(2Y3)
NetLED15_2: LED15.2(A) R86.1
NetLED16_1: LED16.1(K) U5.3(2Y4)
NetLED16_2: LED16.2(A) R87.1
NetLED17_1: LED17.1(K) U6.18(1Y1)
NetLED17_2: LED17.2(A) R88.1
NetLED18_1: LED18.1(K) U6.16(1Y2)
NetLED18_2: LED18.2(A) R89.1
NetLED19_1: LED19.1(K) U6.14(1Y3)
NetLED19_2: LED19.2(A) R90.1
NetLED20_1: LED20.1(K) U6.12(1Y4)
NetLED20_2: LED20.2(A) R91.1
NetLED21_1: LED21.1(K) U6.9(2Y1)
NetLED21_2: LED21.2(A) R92.1
NetLED22_1: LED22.1(K) U6.7(2Y2)
NetLED22_2: LED22.2(A) R93.1
NetLED23_1: LED23.1(K) U6.5(2Y3)
NetLED23_2: LED23.2(A) R94.1
NetLED24_1: LED24.1(K) U6.3(2Y4)
NetLED24_2: LED24.2(A) R95.1
NetLED25_1: LED25.1(K) U7.18(1Y1)
NetLED25_2: LED25.2(A) R96.2
NetLED26_1: LED26.1(K) U7.16(1Y2)
NetLED26_2: LED26.2(A) R97.2
NetLED27_1: LED27.1(K) U7.14(1Y3)
NetLED27_2: LED27.2(A) R98.2
NetLED28_1: LED28.1(K) U7.12(1Y4)
NetLED28_2: LED28.2(A) R99.2
NetLED29_1: LED29.1(K) U7.9(2Y1)
NetLED29_2: LED29.2(A) R100.2
NetLED30_1: LED30.1(K) U7.7(2Y2)
NetLED30_2: LED30.2(A) R101.2
NetLED31_1: LED31.1(K) U7.5(2Y3)
NetLED31_2: LED31.2(A) R102.2
NetLED32_1: LED32.1(K) U7.3(2Y4)
NetLED32_2: LED32.2(A) R103.2
NetLED33_1: LED33.1(K) U8.18(1Y1)
NetLED33_2: LED33.2(A) R112.2
NetLED34_1: LED34.1(K) U8.16(1Y2)
NetLED34_2: LED34.2(A) R113.2
NetLED35_1: LED35.1(K) U8.14(1Y3)
NetLED35_2: LED35.2(A) R114.2
NetLED36_1: LED36.1(K) U8.12(1Y4)
NetLED36_2: LED36.2(A) R115.2
NetLED37_1: LED37.1(K) U8.9(2Y1)
NetLED37_2: LED37.2(A) R116.2
NetLED38_2: LED38.2(A) R117.2
NetLED39_1: LED39.1(K) U8.5(2Y3)
NetLED39_2: LED39.2(A) R118.2
NetLED48_1: LED48.1(K) R137.2
NetLED48_2: LED48.2(A) R135.2
NetLED49_1: LED49.1(K) R138.2
NetLED49_2: LED49.2(A) R136.2
NetPC0_1: PC0.1(K) R134.2
NetPC0_2: PC0.2(A) R126.2
NetPC1_1: PC1.1(K) R133.2
NetPC1_2: PC1.2(A) R125.2
NetPC2_1: PC2.1(K) R132.2
NetPC2_2: PC2.2(A) R124.2
NetPC3_1: PC3.1(K) R131.2
NetPC3_2: PC3.2(A) R123.2
NetPC4_1: PC4.1(K) R130.2
NetPC4_2: PC4.2(A) R122.2
NetPC5_1: PC5.1(K) R129.2
NetPC5_2: PC5.2(A) R121.2
NetPC6_1: PC6.1(K) R128.2
NetPC6_2: PC6.2(A) R120.2
NetPC7_1: PC7.1(K) R127.2
NetPC7_2: PC7.2(A) R119.2
NetTP18_1: TP18.1 U8.17(2A4)
NetTP19_1: TP19.1 U8.3(2Y4)

### Notes on the sheet
- Print Date
- (in symbol TitleBlock) Title:; Project:; Engineer:; ABS Data Systems, Inc.; 317 Sebastian Crossings Blvd; Sebastian, FL 32958; Date:; Revision; (858) 254-7776; www.absdatasystems.com; Sheet; of

### Library data of the parts
IRQ0-IRQ7 = 150060RS75000: Wurth Elektronik 0603 red; Manufacturer: Wurth Electronics; Manufacturer Part Number: 150060GS75000; Wavelength: 520nm; Viewing Angle: 140°; Lens Style: Clear,Rectangular; Luminous Intensity: 430mcd; Forward Current: 30mA; Forward Voltage: 3.2V; Test Current: 20mA; Supplier 1: Digi-Key; RoHS: Yes; Category: LEDs; Stock 1: 71509; Pricing 1: 1=0.14000, 50=0.13300, 100=0.11400, 500=0.09900 (USD); Mount: Surface Mount; Case/Package: 0603; Color: Green; Case Code (Metric): 1608; Case Code (Imperial): 0603; Min Operating Temperature: -40°C; Max Operating Temperature: 85°C; Package Quantity: 4000; Packaging: Tape and Reel; Dominant Wavelength: 520nm; Length: 1.6mm; Width: 0.8mm; Height: 0.7mm; REACH SVHC: Unknown; Lead Free: Lead Free; ComponentLink1URL: https://datasheet.ciiva.com/29562/150060gs75000-29562868.pdf?src-supplier=Digi-Key; ComponentLink1Description: https://datasheet.ciiva.com/29562/150060gs75000-29562868.pdf?src-supplier=Digi-Key; ComponentLink2URL: https://datasheet.ciiva.com/29279/759427-da-01-en-chipled-0603-w-kl-gruen-150060gs75000-29279201.pdf?src-supplier=Conrad; ComponentLink2Description: https://datasheet.ciiva.com/29279/759427-da-01-en-chipled-0603-w-kl-gruen-150060gs75000-29279201.pdf?src-supplier=Conrad; ComponentLink3URL: https://datasheet.ciiva.com/29562/150060gs75000-29562869.pdf?src-supplier=Digi-Key; ComponentLink3Description: https://datasheet.ciiva.com/29562/150060gs75000-29562869.pdf?src-supplier=Digi-Key; ComponentLink4URL: https://datasheet.ciiva.com/29562/150060gs75000-29562870.pdf?src-supplier=Digi-Key; ComponentLink4Description: https://datasheet.ciiva.com/29562/150060gs75000-29562870.pdf?src-supplier=Digi-Key
LED9-LED24 = 150060GS75000: Wurth Elektronik 0603 green; Manufacturer: Wurth Electronics; Wavelength: 520nm; Viewing Angle: 140°; Lens Style: Clear,Rectangular; Luminous Intensity: 430mcd; Forward Current: 30mA; Forward Voltage: 3.2V; Test Current: 20mA; Supplier 1: Digi-Key; Manufacturer Part Number: 150060GS75000; RoHS: Yes; Category: LEDs; Stock 1: 71509; Pricing 1: 1=0.14000, 50=0.13300, 100=0.11400, 500=0.09900 (USD); Mount: Surface Mount; Case/Package: 0603; Color: Green; Case Code (Metric): 1608; Case Code (Imperial): 0603; Min Operating Temperature: -40°C; Max Operating Temperature: 85°C; Package Quantity: 4000; Packaging: Tape and Reel; Dominant Wavelength: 520nm; Length: 1.6mm; Width: 0.8mm; Height: 0.7mm; REACH SVHC: Unknown; Lead Free: Lead Free; ComponentLink1URL: https://datasheet.ciiva.com/29562/150060gs75000-29562868.pdf?src-supplier=Digi-Key; ComponentLink1Description: https://datasheet.ciiva.com/29562/150060gs75000-29562868.pdf?src-supplier=Digi-Key; ComponentLink2URL: https://datasheet.ciiva.com/29279/759427-da-01-en-chipled-0603-w-kl-gruen-150060gs75000-29279201.pdf?src-supplier=Conrad; ComponentLink2Description: https://datasheet.ciiva.com/29279/759427-da-01-en-chipled-0603-w-kl-gruen-150060gs75000-29279201.pdf?src-supplier=Conrad; ComponentLink3URL: https://datasheet.ciiva.com/29562/150060gs75000-29562869.pdf?src-supplier=Digi-Key; ComponentLink3Description: https://datasheet.ciiva.com/29562/150060gs75000-29562869.pdf?src-supplier=Digi-Key; ComponentLink4URL: https://datasheet.ciiva.com/29562/150060gs75000-29562870.pdf?src-supplier=Digi-Key; ComponentLink4Description: https://datasheet.ciiva.com/29562/150060gs75000-29562870.pdf?src-supplier=Digi-Key
LED25-LED32 = 150060BS75000: Wurth Elektronik 0603 blue; Manufacturer: Wurth Electronics; Manufacturer Part Number: 150060GS75000; Color: Green; Wavelength: 520nm; Viewing Angle: 140°; Lens Style: Clear,Rectangular; Luminous Intensity: 430mcd; Forward Current: 30mA; Forward Voltage: 3.2V; Test Current: 20mA; Supplier 1: Digi-Key; RoHS: Yes; Category: LEDs; Stock 1: 71509; Pricing 1: 1=0.14000, 50=0.13300, 100=0.11400, 500=0.09900 (USD); Mount: Surface Mount; Case/Package: 0603; Case Code (Metric): 1608; Case Code (Imperial): 0603; Min Operating Temperature: -40°C; Max Operating Temperature: 85°C; Package Quantity: 4000; Packaging: Tape and Reel; Dominant Wavelength: 520nm; Length: 1.6mm; Width: 0.8mm; Height: 0.7mm; REACH SVHC: Unknown; Lead Free: Lead Free; ComponentLink1URL: https://datasheet.ciiva.com/29562/150060gs75000-29562868.pdf?src-supplier=Digi-Key; ComponentLink1Description: https://datasheet.ciiva.com/29562/150060gs75000-29562868.pdf?src-supplier=Digi-Key; ComponentLink2URL: https://datasheet.ciiva.com/29279/759427-da-01-en-chipled-0603-w-kl-gruen-150060gs75000-29279201.pdf?src-supplier=Conrad; ComponentLink2Description: https://datasheet.ciiva.com/29279/759427-da-01-en-chipled-0603-w-kl-gruen-150060gs75000-29279201.pdf?src-supplier=Conrad; ComponentLink3URL: https://datasheet.ciiva.com/29562/150060gs75000-29562869.pdf?src-supplier=Digi-Key; ComponentLink3Description: https://datasheet.ciiva.com/29562/150060gs75000-29562869.pdf?src-supplier=Digi-Key; ComponentLink4URL: https://datasheet.ciiva.com/29562/150060gs75000-29562870.pdf?src-supplier=Digi-Key; ComponentLink4Description: https://datasheet.ciiva.com/29562/150060gs75000-29562870.pdf?src-supplier=Digi-Key
LED33-LED39 LED48 = 150060AS75000: Wurth Elektronik 0603 amber; Manufacturer: Wurth Electronics; Manufacturer Part Number: 150060GS75000; Color: Green; Wavelength: 520nm; Viewing Angle: 140°; Lens Style: Clear,Rectangular; Luminous Intensity: 430mcd; Forward Current: 30mA; Forward Voltage: 3.2V; Test Current: 20mA; Supplier 1: Digi-Key; RoHS: Yes; Category: LEDs; Stock 1: 71509; Pricing 1: 1=0.14000, 50=0.13300, 100=0.11400, 500=0.09900 (USD); Mount: Surface Mount; Case/Package: 0603; Case Code (Metric): 1608; Case Code (Imperial): 0603; Min Operating Temperature: -40°C; Max Operating Temperature: 85°C; Package Quantity: 4000; Packaging: Tape and Reel; Dominant Wavelength: 520nm; Length: 1.6mm; Width: 0.8mm; Height: 0.7mm; REACH SVHC: Unknown; Lead Free: Lead Free; ComponentLink1URL: https://datasheet.ciiva.com/29562/150060gs75000-29562868.pdf?src-supplier=Digi-Key; ComponentLink1Description: https://datasheet.ciiva.com/29562/150060gs75000-29562868.pdf?src-supplier=Digi-Key; ComponentLink2URL: https://datasheet.ciiva.com/29279/759427-da-01-en-chipled-0603-w-kl-gruen-150060gs75000-29279201.pdf?src-supplier=Conrad; ComponentLink2Description: https://datasheet.ciiva.com/29279/759427-da-01-en-chipled-0603-w-kl-gruen-150060gs75000-29279201.pdf?src-supplier=Conrad; ComponentLink3URL: https://datasheet.ciiva.com/29562/150060gs75000-29562869.pdf?src-supplier=Digi-Key; ComponentLink3Description: https://datasheet.ciiva.com/29562/150060gs75000-29562869.pdf?src-supplier=Digi-Key; ComponentLink4URL: https://datasheet.ciiva.com/29562/150060gs75000-29562870.pdf?src-supplier=Digi-Key; ComponentLink4Description: https://datasheet.ciiva.com/29562/150060gs75000-29562870.pdf?src-supplier=Digi-Key
LED49 = 150060RS75000: Wurth Elektronik 0603 red; Manufacturer: Wurth Electronics; Manufacturer Part Number: 150060GS75000; Color: Green; Wavelength: 520nm; Viewing Angle: 140°; Lens Style: Clear,Rectangular; Luminous Intensity: 430mcd; Forward Current: 30mA; Forward Voltage: 3.2V; Test Current: 20mA; Supplier 1: Digi-Key; RoHS: Yes; Category: LEDs; Stock 1: 71509; Pricing 1: 1=0.14000, 50=0.13300, 100=0.11400, 500=0.09900 (USD); Mount: Surface Mount; Case/Package: 0603; Case Code (Metric): 1608; Case Code (Imperial): 0603; Min Operating Temperature: -40°C; Max Operating Temperature: 85°C; Package Quantity: 4000; Packaging: Tape and Reel; Dominant Wavelength: 520nm; Length: 1.6mm; Width: 0.8mm; Height: 0.7mm; REACH SVHC: Unknown; Lead Free: Lead Free; ComponentLink1URL: https://datasheet.ciiva.com/29562/150060gs75000-29562868.pdf?src-supplier=Digi-Key; ComponentLink1Description: https://datasheet.ciiva.com/29562/150060gs75000-29562868.pdf?src-supplier=Digi-Key; ComponentLink2URL: https://datasheet.ciiva.com/29279/759427-da-01-en-chipled-0603-w-kl-gruen-150060gs75000-29279201.pdf?src-supplier=Conrad; ComponentLink2Description: https://datasheet.ciiva.com/29279/759427-da-01-en-chipled-0603-w-kl-gruen-150060gs75000-29279201.pdf?src-supplier=Conrad; ComponentLink3URL: https://datasheet.ciiva.com/29562/150060gs75000-29562869.pdf?src-supplier=Digi-Key; ComponentLink3Description: https://datasheet.ciiva.com/29562/150060gs75000-29562869.pdf?src-supplier=Digi-Key; ComponentLink4URL: https://datasheet.ciiva.com/29562/150060gs75000-29562870.pdf?src-supplier=Digi-Key; ComponentLink4Description: https://datasheet.ciiva.com/29562/150060gs75000-29562870.pdf?src-supplier=Digi-Key
PC0-PC7 = 150060AS75000: Wurth Elektronik 0603 amber; Manufacturer: Wurth Electronics; Manufacturer Part Number: 150060GS75000; Wavelength: 520nm; Viewing Angle: 140°; Lens Style: Clear,Rectangular; Luminous Intensity: 430mcd; Forward Current: 30mA; Forward Voltage: 3.2V; Test Current: 20mA; Supplier 1: Digi-Key; RoHS: Yes; Category: LEDs; Stock 1: 71509; Pricing 1: 1=0.14000, 50=0.13300, 100=0.11400, 500=0.09900 (USD); Mount: Surface Mount; Case/Package: 0603; Color: Green; Case Code (Metric): 1608; Case Code (Imperial): 0603; Min Operating Temperature: -40°C; Max Operating Temperature: 85°C; Package Quantity: 4000; Packaging: Tape and Reel; Dominant Wavelength: 520nm; Length: 1.6mm; Width: 0.8mm; Height: 0.7mm; REACH SVHC: Unknown; Lead Free: Lead Free; ComponentLink1URL: https://datasheet.ciiva.com/29562/150060gs75000-29562868.pdf?src-supplier=Digi-Key; ComponentLink1Description: https://datasheet.ciiva.com/29562/150060gs75000-29562868.pdf?src-supplier=Digi-Key; ComponentLink2URL: https://datasheet.ciiva.com/29279/759427-da-01-en-chipled-0603-w-kl-gruen-150060gs75000-29279201.pdf?src-supplier=Conrad; ComponentLink2Description: https://datasheet.ciiva.com/29279/759427-da-01-en-chipled-0603-w-kl-gruen-150060gs75000-29279201.pdf?src-supplier=Conrad; ComponentLink3URL: https://datasheet.ciiva.com/29562/150060gs75000-29562869.pdf?src-supplier=Digi-Key; ComponentLink3Description: https://datasheet.ciiva.com/29562/150060gs75000-29562869.pdf?src-supplier=Digi-Key; ComponentLink4URL: https://datasheet.ciiva.com/29562/150060gs75000-29562870.pdf?src-supplier=Digi-Key; ComponentLink4Description: https://datasheet.ciiva.com/29562/150060gs75000-29562870.pdf?src-supplier=Digi-Key
R72-R79 R112-R126 R135 R136 = AC0603FR-7W1KL_1: YAGEO 0603 1k ohm; Manufacturer_Name: KEMET; Manufacturer_Part_Number: RC0603JR-070RL; Geometry.Height: 0.55mm; Mouser Part Number: 603-RC0603JR-070RL; Mouser Price/Stock: https://www.mouser.co.uk/ProductDetail/YAGEO/RC0603JR-070RL?qs=2cAdsCoAWRGWyPcuXgGiXQ%3D%3D; Datasheet Link: https://datasheet.datasheetarchive.com/originals/distributors/Datasheets_SAMA/902f9e387b938f871d31120f5fc1d65e.pdf
R80-R103 = RC0603FR-104K7L: YAGEO 0603 4.7k; Manufacturer_Name: KEMET; Manufacturer_Part_Number: RC0603JR-070RL; Geometry.Height: 0.55mm; Mouser Part Number: 603-RC0603JR-070RL; Mouser Price/Stock: https://www.mouser.co.uk/ProductDetail/YAGEO/RC0603JR-070RL?qs=2cAdsCoAWRGWyPcuXgGiXQ%3D%3D; Datasheet Link: https://datasheet.datasheetarchive.com/originals/distributors/Datasheets_SAMA/902f9e387b938f871d31120f5fc1d65e.pdf
R104-R111 R127-R134 R137 R138 = RC0603JR-070RL: as R7 on sheet CPU_Board; Mouser Part Number: 603-RC0603JR-070RL; Mouser Price/Stock: https://www.mouser.co.uk/ProductDetail/YAGEO/RC0603JR-070RL?qs=2cAdsCoAWRGWyPcuXgGiXQ%3D%3D; Manufacturer_Part_Number: RC0603JR-070RL; Datasheet Link: https://datasheet.datasheetarchive.com/originals/distributors/Datasheets_SAMA/902f9e387b938f871d31120f5fc1d65e.pdf
TP18 TP19 = TP: as TP1 on sheet CPU_Board; Supplier 1: Digi-Key; RoHS: Yes; Category: Headers and Wire Housings; Stock 1: 227; Pricing 1: 1=2.85000, 10=2.73600, 100=2.28000, 500=1.93800, 1000=1.65300, 5000=1.48200 (USD); Mount: Through Hole; Contact Plating: Gold; Contact Material: Bronze; Housing Material: Polyester; Housing Color: Black; Color: Black; Min Operating Temperature: -55°C; Max Operating Temperature: 125°C; Number of Rows: 2; Termination: Solder; Packaging: Rail/Tube; Orientation: Straight; Number of Positions: 16; Length: 27.94mm; Depth: 9.27mm; Contact Mating Length: 0.25inch; REACH SVHC: No SVHC; ComponentLink1URL: https://datasheet.ciiva.com/739/tst-mkt-739845.pdf?src-supplier=Digi-Key; ComponentLink1Description: https://datasheet.ciiva.com/739/tst-mkt-739845.pdf?src-supplier=Digi-Key; ComponentLink2URL: https://datasheet.ciiva.com/10018/htst-10018510.pdf?src-supplier=Avnet; ComponentLink2Description: https://datasheet.ciiva.com/10018/htst-10018510.pdf?src-supplier=Avnet
U5-U8 = SN74ABT240ADBR: Octal Buffers/Drivers With 3-State Outputs; Manufacturer_Name: Texas Instruments; Geometry.Height: 2mm; Mouser Part Number: 595-SN74ABT240ADBR; Mouser Price/Stock: https://www.mouser.co.uk/ProductDetail/Texas-Instruments/SN74ABT240ADBR?qs=JHHQeKcAU3Dt82k%252BVyiYdw%3D%3D; Manufacturer_Part_Number: SN74ABT240ADBR; Datasheet Link: http://www.ti.com/lit/gpn/sn74abt240a

## Sheet LED_Monitor_2.SchDoc
size Tabloid; SheetNumber: 3; SheetTotal: 8
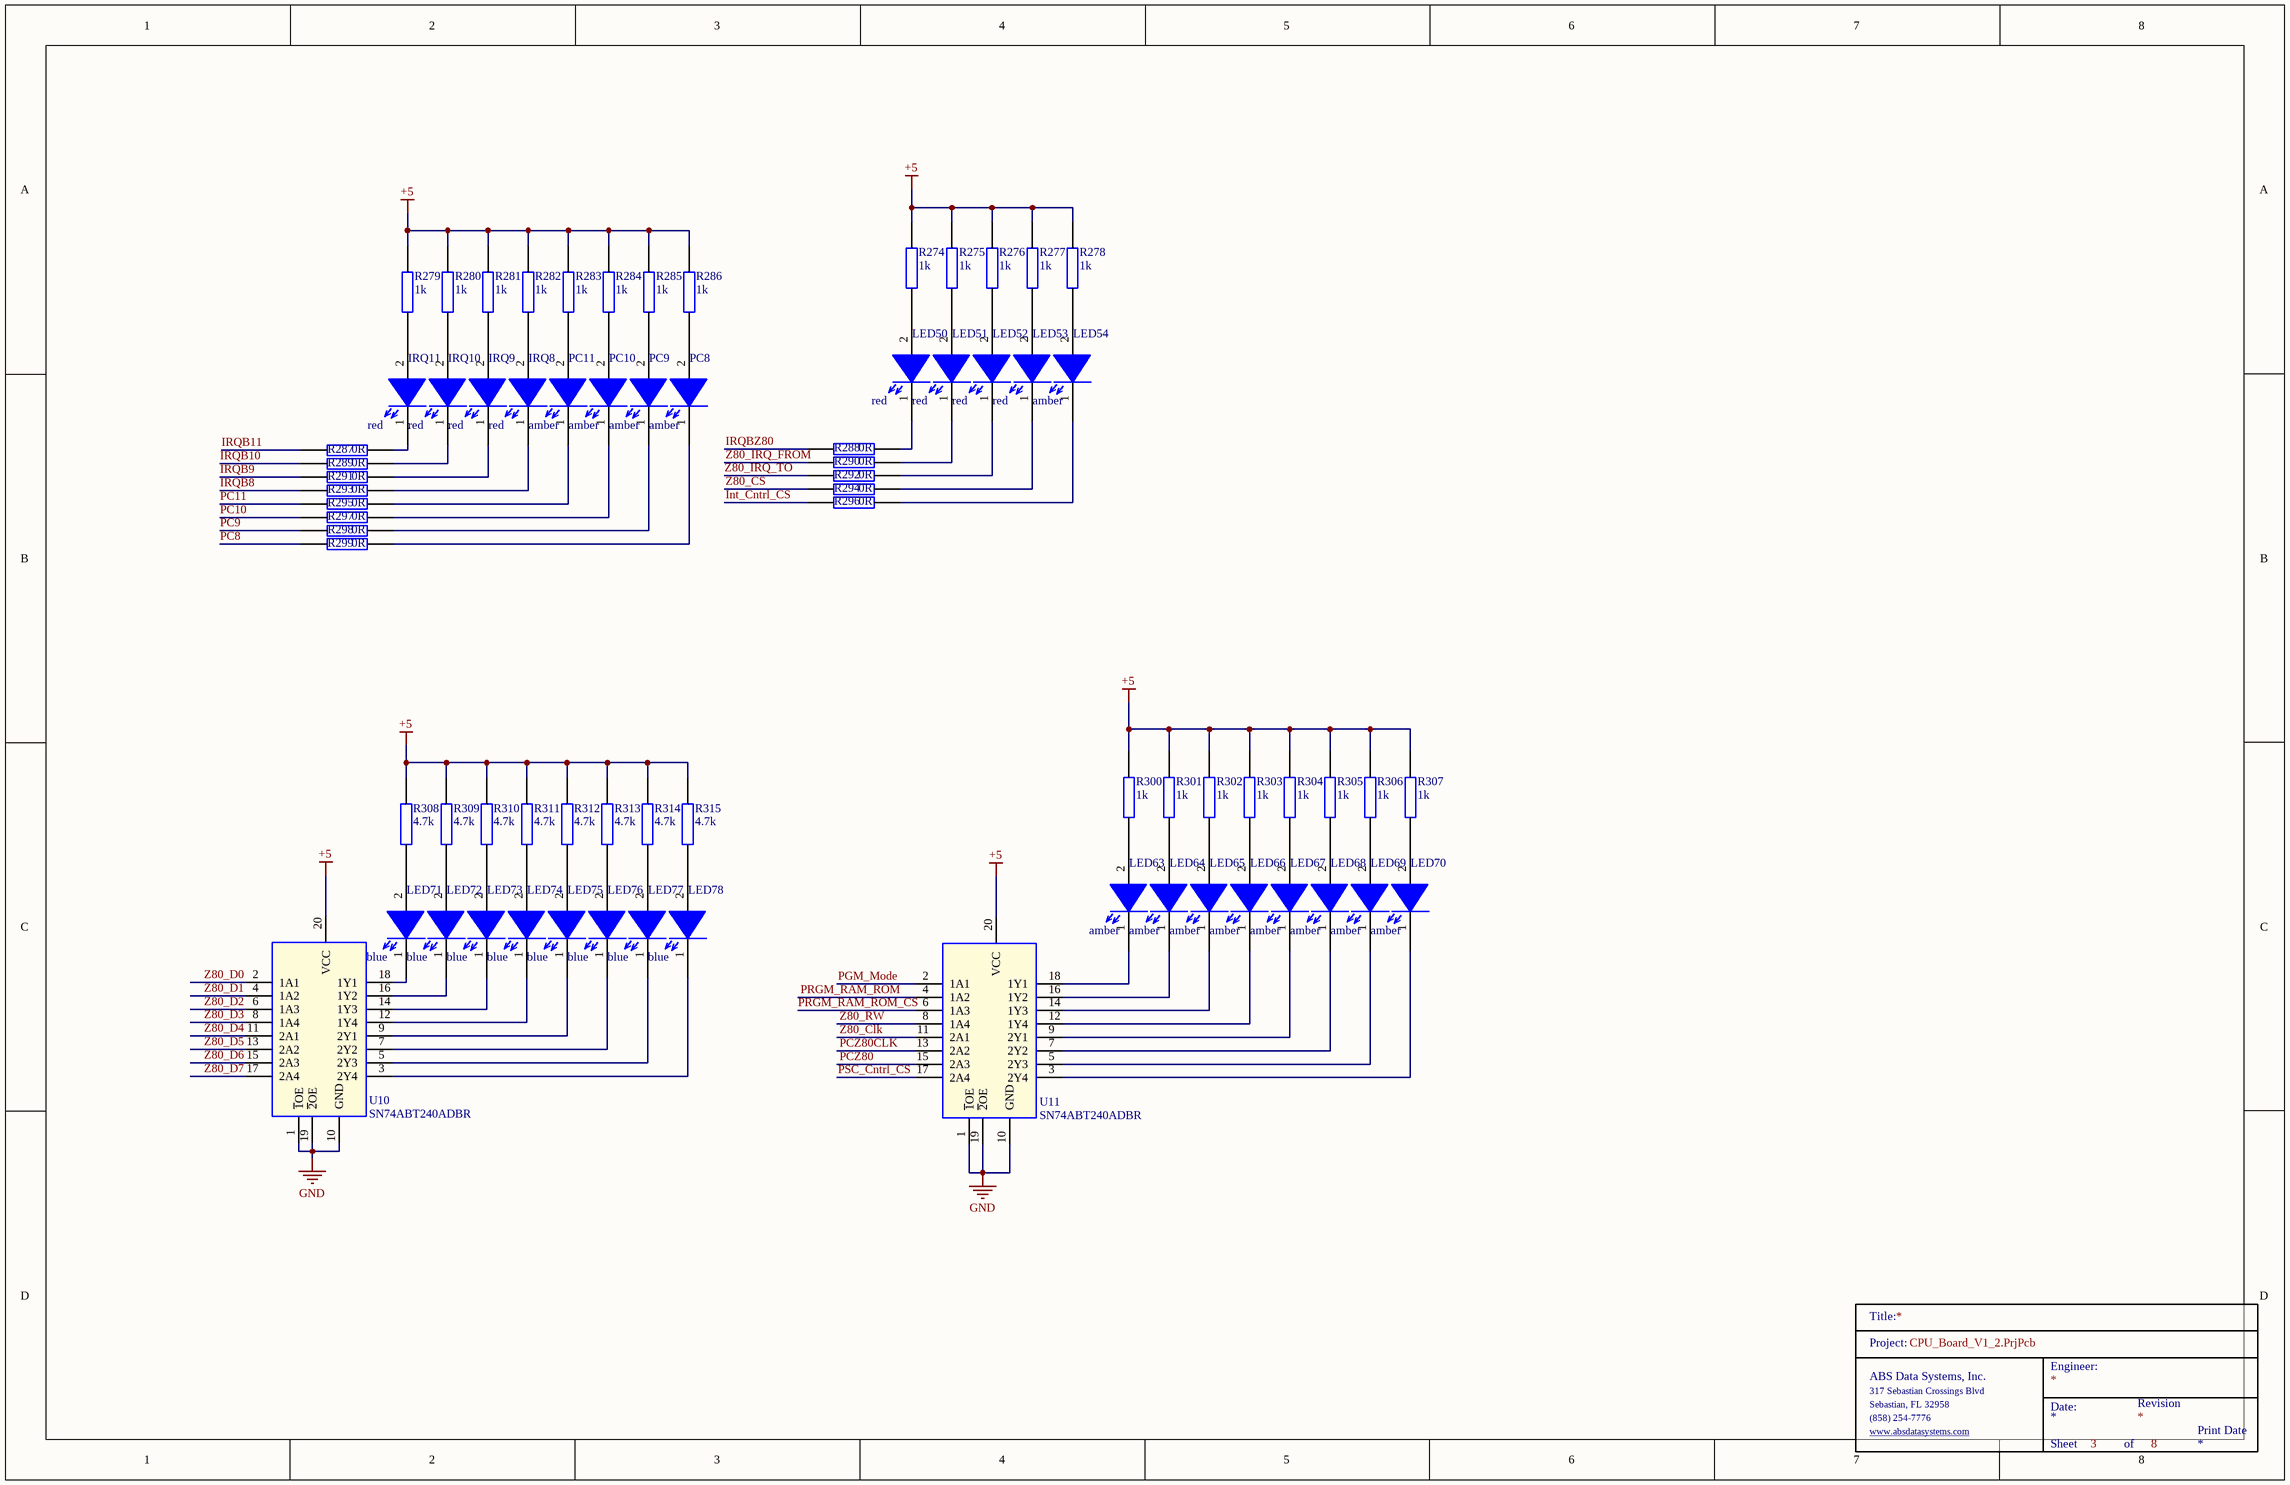
[diagram p2: LED_Monitor_2.SchDoc]

### Parts
(Parts that share a designator on the sheet are numbered #1, #2 ... from top to bottom, then left to right.)
IRQ8  red  [0603_Diode]
IRQ9  red  [0603_Diode]
IRQ10  red  [0603_Diode]
IRQ11  red  [0603_Diode]
LED50  red  [0603_Diode]
LED51  red  [0603_Diode]
LED52  red  [0603_Diode]
LED53  red  [0603_Diode]
LED54  amber  [0603_Diode]
LED63  amber  [0603_Diode]
LED64  amber  [0603_Diode]
LED65  amber  [0603_Diode]
LED66  amber  [0603_Diode]
LED67  amber  [0603_Diode]
LED68  amber  [0603_Diode]
LED69  amber  [0603_Diode]
LED70  amber  [0603_Diode]
LED71  blue  [0603_Diode]
LED72  blue  [0603_Diode]
LED73  blue  [0603_Diode]
LED74  blue  [0603_Diode]
LED75  blue  [0603_Diode]
LED76  blue  [0603_Diode]
LED77  blue  [0603_Diode]
LED78  blue  [0603_Diode]
PC8  amber  [0603_Diode]
PC9  amber  [0603_Diode]
PC10  amber  [0603_Diode]
PC11  amber  [0603_Diode]
R274  1k  [0603]
R275  1k  [0603]
R276  1k  [0603]
R277  1k  [0603]
R278  1k  [0603]
R279  1k  [0603]
R280  1k  [0603]
R281  1k  [0603]
R282  1k  [0603]
R283  1k  [0603]
R284  1k  [0603]
R285  1k  [0603]
R286  1k  [0603]
R287  0R  [0603]
R288  0R  [0603]
R289  0R  [0603]
R290  0R  [0603]
R291  0R  [0603]
R292  0R  [0603]
R293  0R  [0603]
R294  0R  [0603]
R295  0R  [0603]
R296  0R  [0603]
R297  0R  [0603]
R298  0R  [0603]
R299  0R  [0603]
R300  1k  [0603]
R301  1k  [0603]
R302  1k  [0603]
R303  1k  [0603]
R304  1k  [0603]
R305  1k  [0603]
R306  1k  [0603]
R307  1k  [0603]
R308  4.7k  [0603]
R309  4.7k  [0603]
R310  4.7k  [0603]
R311  4.7k  [0603]
R312  4.7k  [0603]
R313  4.7k  [0603]
R314  4.7k  [0603]
R315  4.7k  [0603]
TitleBlock_2#2  TitleBlock  (value not drawn)  (graphical)
U10  SN74ABT240ADBR  [SOP65P780X200-20N]
U11  SN74ABT240ADBR  [SOP65P780X200-20N]

### Nets
+5: R274.1 R275.1 R276.1 R277.1 R278.1 R279.1 R280.1 R281.1 R282.1 R283.1 R284.1 R285.1 R286.1 R300.1 R301.1 R302.1 R303.1 R304.1 R305.1 R306.1 R307.1 R308.1 R309.1 R310.1 R311.1 R312.1 R313.1 R314.1 R315.1 U10.20(VCC) U11.20(VCC)
GND: U10.1(~{1}OE) U10.10(GND) U10.19(~{2}OE) U11.1(~{1}OE) U11.10(GND) U11.19(~{2}OE)
Int_Cntrl_CS: R296.1
IRQB8: R293.1
IRQB9: R291.1
IRQB10: R289.1
IRQB11: R287.1
IRQBZ80: R288.1
PC8: R299.1
PC9: R298.1
PC10: R297.1
PC11: R295.1
PCZ80: U11.15(2A3)
PCZ80CLK: U11.13(2A2)
PGM_Mode: U11.2(1A1)
PRGM_RAM_ROM: U11.4(1A2)
PRGM_RAM_ROM_CS: U11.6(1A3)
PSC_Cntrl_CS: U11.17(2A4)
Z80_Clk: U11.11(2A1)
Z80_CS: R294.1
Z80_D0: U10.2(1A1)
Z80_D1: U10.4(1A2)
Z80_D2: U10.6(1A3)
Z80_D3: U10.8(1A4)
Z80_D4: U10.11(2A1)
Z80_D5: U10.13(2A2)
Z80_D6: U10.15(2A3)
Z80_D7: U10.17(2A4)
Z80_IRQ_FROM: R290.1
Z80_IRQ_TO: R292.1
Z80_RW: U11.8(1A4)
NetIRQ8_1: IRQ8.1(K) R293.2
NetIRQ8_2: IRQ8.2(A) R282.2
NetIRQ9_1: IRQ9.1(K) R291.2
NetIRQ9_2: IRQ9.2(A) R281.2
NetIRQ10_1: IRQ10.1(K) R289.2
NetIRQ10_2: IRQ10.2(A) R280.2
NetIRQ11_1: IRQ11.1(K) R287.2
NetIRQ11_2: IRQ11.2(A) R279.2
NetLED50_1: LED50.1(K) R288.2
NetLED50_2: LED50.2(A) R274.2
NetLED51_1: LED51.1(K) R290.2
NetLED51_2: LED51.2(A) R275.2
NetLED52_1: LED52.1(K) R292.2
NetLED52_2: LED52.2(A) R276.2
NetLED53_1: LED53.1(K) R294.2
NetLED53_2: LED53.2(A) R277.2
NetLED54_1: LED54.1(K) R296.2
NetLED54_2: LED54.2(A) R278.2
NetLED63_1: LED63.1(K) U11.18(1Y1)
NetLED63_2: LED63.2(A) R300.2
NetLED64_1: LED64.1(K) U11.16(1Y2)
NetLED64_2: LED64.2(A) R301.2
NetLED65_1: LED65.1(K) U11.14(1Y3)
NetLED65_2: LED65.2(A) R302.2
NetLED66_1: LED66.1(K) U11.12(1Y4)
NetLED66_2: LED66.2(A) R303.2
NetLED67_1: LED67.1(K) U11.9(2Y1)
NetLED67_2: LED67.2(A) R304.2
NetLED68_1: LED68.1(K) U11.7(2Y2)
NetLED68_2: LED68.2(A) R305.2
NetLED69_1: LED69.1(K) U11.5(2Y3)
NetLED69_2: LED69.2(A) R306.2
NetLED70_1: LED70.1(K) U11.3(2Y4)
NetLED70_2: LED70.2(A) R307.2
NetLED71_1: LED71.1(K) U10.18(1Y1)
NetLED71_2: LED71.2(A) R308.2
NetLED72_1: LED72.1(K) U10.16(1Y2)
NetLED72_2: LED72.2(A) R309.2
NetLED73_1: LED73.1(K) U10.14(1Y3)
NetLED73_2: LED73.2(A) R310.2
NetLED74_1: LED74.1(K) U10.12(1Y4)
NetLED74_2: LED74.2(A) R311.2
NetLED75_1: LED75.1(K) U10.9(2Y1)
NetLED75_2: LED75.2(A) R312.2
NetLED76_1: LED76.1(K) U10.7(2Y2)
NetLED76_2: LED76.2(A) R313.2
NetLED77_1: LED77.1(K) U10.5(2Y3)
NetLED77_2: LED77.2(A) R314.2
NetLED78_1: LED78.1(K) U10.3(2Y4)
NetLED78_2: LED78.2(A) R315.2
NetPC8_1: PC8.1(K) R299.2
NetPC8_2: PC8.2(A) R286.2
NetPC9_1: PC9.1(K) R298.2
NetPC9_2: PC9.2(A) R285.2
NetPC10_1: PC10.1(K) R297.2
NetPC10_2: PC10.2(A) R284.2
NetPC11_1: PC11.1(K) R295.2
NetPC11_2: PC11.2(A) R283.2

### Notes on the sheet
- Print Date
- (in symbol TitleBlock) Title:; Project:; Engineer:; ABS Data Systems, Inc.; 317 Sebastian Crossings Blvd; Sebastian, FL 32958; Date:; Revision; (858) 254-7776; www.absdatasystems.com; Sheet; of

### Library data of the parts
IRQ8-IRQ11 = 150060RS75000: as IRQ0 on sheet LED_Monitor; Supplier 1: Digi-Key; RoHS: Yes; Category: LEDs; Stock 1: 71509; Pricing 1: 1=0.14000, 50=0.13300, 100=0.11400, 500=0.09900 (USD); Mount: Surface Mount; Case/Package: 0603; Color: Green; Case Code (Metric): 1608; Case Code (Imperial): 0603; Min Operating Temperature: -40°C; Max Operating Temperature: 85°C; Package Quantity: 4000; Packaging: Tape and Reel; Dominant Wavelength: 520nm; Length: 1.6mm; Width: 0.8mm; Height: 0.7mm; REACH SVHC: Unknown; Lead Free: Lead Free; ComponentLink1URL: https://datasheet.ciiva.com/29562/150060gs75000-29562868.pdf?src-supplier=Digi-Key; ComponentLink1Description: https://datasheet.ciiva.com/29562/150060gs75000-29562868.pdf?src-supplier=Digi-Key; ComponentLink2URL: https://datasheet.ciiva.com/29279/759427-da-01-en-chipled-0603-w-kl-gruen-150060gs75000-29279201.pdf?src-supplier=Conrad; ComponentLink2Description: https://datasheet.ciiva.com/29279/759427-da-01-en-chipled-0603-w-kl-gruen-150060gs75000-29279201.pdf?src-supplier=Conrad; ComponentLink3URL: https://datasheet.ciiva.com/29562/150060gs75000-29562869.pdf?src-supplier=Digi-Key; ComponentLink3Description: https://datasheet.ciiva.com/29562/150060gs75000-29562869.pdf?src-supplier=Digi-Key; ComponentLink4URL: https://datasheet.ciiva.com/29562/150060gs75000-29562870.pdf?src-supplier=Digi-Key; ComponentLink4Description: https://datasheet.ciiva.com/29562/150060gs75000-29562870.pdf?src-supplier=Digi-Key
LED50-LED53 = 150060RS75000: as LED49 on sheet LED_Monitor; Supplier 1: Digi-Key; RoHS: Yes; Category: LEDs; Stock 1: 71509; Pricing 1: 1=0.14000, 50=0.13300, 100=0.11400, 500=0.09900 (USD); Mount: Surface Mount; Case/Package: 0603; Case Code (Metric): 1608; Case Code (Imperial): 0603; Min Operating Temperature: -40°C; Max Operating Temperature: 85°C; Package Quantity: 4000; Packaging: Tape and Reel; Dominant Wavelength: 520nm; Length: 1.6mm; Width: 0.8mm; Height: 0.7mm; REACH SVHC: Unknown; Lead Free: Lead Free; ComponentLink1URL: https://datasheet.ciiva.com/29562/150060gs75000-29562868.pdf?src-supplier=Digi-Key; ComponentLink1Description: https://datasheet.ciiva.com/29562/150060gs75000-29562868.pdf?src-supplier=Digi-Key; ComponentLink2URL: https://datasheet.ciiva.com/29279/759427-da-01-en-chipled-0603-w-kl-gruen-150060gs75000-29279201.pdf?src-supplier=Conrad; ComponentLink2Description: https://datasheet.ciiva.com/29279/759427-da-01-en-chipled-0603-w-kl-gruen-150060gs75000-29279201.pdf?src-supplier=Conrad; ComponentLink3URL: https://datasheet.ciiva.com/29562/150060gs75000-29562869.pdf?src-supplier=Digi-Key; ComponentLink3Description: https://datasheet.ciiva.com/29562/150060gs75000-29562869.pdf?src-supplier=Digi-Key; ComponentLink4URL: https://datasheet.ciiva.com/29562/150060gs75000-29562870.pdf?src-supplier=Digi-Key; ComponentLink4Description: https://datasheet.ciiva.com/29562/150060gs75000-29562870.pdf?src-supplier=Digi-Key
LED54 LED63-LED70 = 150060AS75000: as LED33 on sheet LED_Monitor; Supplier 1: Digi-Key; RoHS: Yes; Category: LEDs; Stock 1: 71509; Pricing 1: 1=0.14000, 50=0.13300, 100=0.11400, 500=0.09900 (USD); Mount: Surface Mount; Case/Package: 0603; Case Code (Metric): 1608; Case Code (Imperial): 0603; Min Operating Temperature: -40°C; Max Operating Temperature: 85°C; Package Quantity: 4000; Packaging: Tape and Reel; Dominant Wavelength: 520nm; Length: 1.6mm; Width: 0.8mm; Height: 0.7mm; REACH SVHC: Unknown; Lead Free: Lead Free; ComponentLink1URL: https://datasheet.ciiva.com/29562/150060gs75000-29562868.pdf?src-supplier=Digi-Key; ComponentLink1Description: https://datasheet.ciiva.com/29562/150060gs75000-29562868.pdf?src-supplier=Digi-Key; ComponentLink2URL: https://datasheet.ciiva.com/29279/759427-da-01-en-chipled-0603-w-kl-gruen-150060gs75000-29279201.pdf?src-supplier=Conrad; ComponentLink2Description: https://datasheet.ciiva.com/29279/759427-da-01-en-chipled-0603-w-kl-gruen-150060gs75000-29279201.pdf?src-supplier=Conrad; ComponentLink3URL: https://datasheet.ciiva.com/29562/150060gs75000-29562869.pdf?src-supplier=Digi-Key; ComponentLink3Description: https://datasheet.ciiva.com/29562/150060gs75000-29562869.pdf?src-supplier=Digi-Key; ComponentLink4URL: https://datasheet.ciiva.com/29562/150060gs75000-29562870.pdf?src-supplier=Digi-Key; ComponentLink4Description: https://datasheet.ciiva.com/29562/150060gs75000-29562870.pdf?src-supplier=Digi-Key
LED71-LED78 = 150060BS75000: as LED25 on sheet LED_Monitor; Supplier 1: Digi-Key; RoHS: Yes; Category: LEDs; Stock 1: 71509; Pricing 1: 1=0.14000, 50=0.13300, 100=0.11400, 500=0.09900 (USD); Mount: Surface Mount; Case/Package: 0603; Case Code (Metric): 1608; Case Code (Imperial): 0603; Min Operating Temperature: -40°C; Max Operating Temperature: 85°C; Package Quantity: 4000; Packaging: Tape and Reel; Dominant Wavelength: 520nm; Length: 1.6mm; Width: 0.8mm; Height: 0.7mm; REACH SVHC: Unknown; Lead Free: Lead Free; ComponentLink1URL: https://datasheet.ciiva.com/29562/150060gs75000-29562868.pdf?src-supplier=Digi-Key; ComponentLink1Description: https://datasheet.ciiva.com/29562/150060gs75000-29562868.pdf?src-supplier=Digi-Key; ComponentLink2URL: https://datasheet.ciiva.com/29279/759427-da-01-en-chipled-0603-w-kl-gruen-150060gs75000-29279201.pdf?src-supplier=Conrad; ComponentLink2Description: https://datasheet.ciiva.com/29279/759427-da-01-en-chipled-0603-w-kl-gruen-150060gs75000-29279201.pdf?src-supplier=Conrad; ComponentLink3URL: https://datasheet.ciiva.com/29562/150060gs75000-29562869.pdf?src-supplier=Digi-Key; ComponentLink3Description: https://datasheet.ciiva.com/29562/150060gs75000-29562869.pdf?src-supplier=Digi-Key; ComponentLink4URL: https://datasheet.ciiva.com/29562/150060gs75000-29562870.pdf?src-supplier=Digi-Key; ComponentLink4Description: https://datasheet.ciiva.com/29562/150060gs75000-29562870.pdf?src-supplier=Digi-Key
PC8-PC11 = 150060AS75000: as PC0 on sheet LED_Monitor; Supplier 1: Digi-Key; RoHS: Yes; Category: LEDs; Stock 1: 71509; Pricing 1: 1=0.14000, 50=0.13300, 100=0.11400, 500=0.09900 (USD); Mount: Surface Mount; Case/Package: 0603; Color: Green; Case Code (Metric): 1608; Case Code (Imperial): 0603; Min Operating Temperature: -40°C; Max Operating Temperature: 85°C; Package Quantity: 4000; Packaging: Tape and Reel; Dominant Wavelength: 520nm; Length: 1.6mm; Width: 0.8mm; Height: 0.7mm; REACH SVHC: Unknown; Lead Free: Lead Free; ComponentLink1URL: https://datasheet.ciiva.com/29562/150060gs75000-29562868.pdf?src-supplier=Digi-Key; ComponentLink1Description: https://datasheet.ciiva.com/29562/150060gs75000-29562868.pdf?src-supplier=Digi-Key; ComponentLink2URL: https://datasheet.ciiva.com/29279/759427-da-01-en-chipled-0603-w-kl-gruen-150060gs75000-29279201.pdf?src-supplier=Conrad; ComponentLink2Description: https://datasheet.ciiva.com/29279/759427-da-01-en-chipled-0603-w-kl-gruen-150060gs75000-29279201.pdf?src-supplier=Conrad; ComponentLink3URL: https://datasheet.ciiva.com/29562/150060gs75000-29562869.pdf?src-supplier=Digi-Key; ComponentLink3Description: https://datasheet.ciiva.com/29562/150060gs75000-29562869.pdf?src-supplier=Digi-Key; ComponentLink4URL: https://datasheet.ciiva.com/29562/150060gs75000-29562870.pdf?src-supplier=Digi-Key; ComponentLink4Description: https://datasheet.ciiva.com/29562/150060gs75000-29562870.pdf?src-supplier=Digi-Key
R274-R286 R300-R307 = AC0603FR-7W1KL_1: as R72 on sheet LED_Monitor; Mouser Part Number: 603-RC0603JR-070RL; Mouser Price/Stock: https://www.mouser.co.uk/ProductDetail/YAGEO/RC0603JR-070RL?qs=2cAdsCoAWRGWyPcuXgGiXQ%3D%3D; Datasheet Link: https://datasheet.datasheetarchive.com/originals/distributors/Datasheets_SAMA/902f9e387b938f871d31120f5fc1d65e.pdf
R287-R299 = RC0603JR-070RL: as R7 on sheet CPU_Board; Mouser Part Number: 603-RC0603JR-070RL; Mouser Price/Stock: https://www.mouser.co.uk/ProductDetail/YAGEO/RC0603JR-070RL?qs=2cAdsCoAWRGWyPcuXgGiXQ%3D%3D; Manufacturer_Part_Number: RC0603JR-070RL; Datasheet Link: https://datasheet.datasheetarchive.com/originals/distributors/Datasheets_SAMA/902f9e387b938f871d31120f5fc1d65e.pdf
R308-R315 = RC0603FR-104K7L: as R80 on sheet LED_Monitor; Mouser Part Number: 603-RC0603JR-070RL; Mouser Price/Stock: https://www.mouser.co.uk/ProductDetail/YAGEO/RC0603JR-070RL?qs=2cAdsCoAWRGWyPcuXgGiXQ%3D%3D; Datasheet Link: https://datasheet.datasheetarchive.com/originals/distributors/Datasheets_SAMA/902f9e387b938f871d31120f5fc1d65e.pdf
U10 U11 = SN74ABT240ADBR: as U5 on sheet LED_Monitor; Mouser Part Number: 595-SN74ABT240ADBR; Mouser Price/Stock: https://www.mouser.co.uk/ProductDetail/Texas-Instruments/SN74ABT240ADBR?qs=JHHQeKcAU3Dt82k%252BVyiYdw%3D%3D; Manufacturer_Part_Number: SN74ABT240ADBR; Datasheet Link: http://www.ti.com/lit/gpn/sn74abt240a